# EAGLE design SfcDip2SoicAdapter (EAGLE 7.6.0)
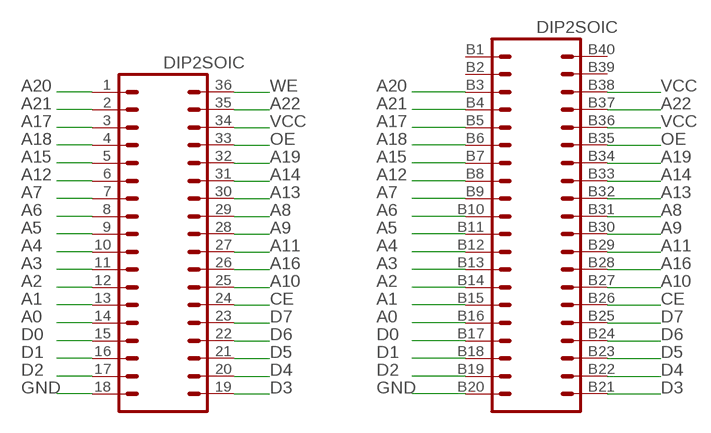
[diagram p0: schematic, sheet 1]

## Parts
DIP2SOIC  DIP36_OPENPTH  [DIP36_OPEN]

## Nets
A0: DIP2SOIC.14 DIP2SOIC.B16
A1: DIP2SOIC.13 DIP2SOIC.B15
A2: DIP2SOIC.12 DIP2SOIC.B14
A3: DIP2SOIC.11 DIP2SOIC.B13
A4: DIP2SOIC.10 DIP2SOIC.B12
A5: DIP2SOIC.9 DIP2SOIC.B11
A6: DIP2SOIC.8 DIP2SOIC.B10
A7: DIP2SOIC.7 DIP2SOIC.B9
A8: DIP2SOIC.29 DIP2SOIC.B31
A9: DIP2SOIC.28 DIP2SOIC.B30
A10: DIP2SOIC.25 DIP2SOIC.B27
A11: DIP2SOIC.27 DIP2SOIC.B29
A12: DIP2SOIC.6 DIP2SOIC.B8
A13: DIP2SOIC.30 DIP2SOIC.B32
A14: DIP2SOIC.31 DIP2SOIC.B33
A15: DIP2SOIC.5 DIP2SOIC.B7
A16: DIP2SOIC.26 DIP2SOIC.B28
A17: DIP2SOIC.3 DIP2SOIC.B5
A18: DIP2SOIC.4 DIP2SOIC.B6
A19: DIP2SOIC.32 DIP2SOIC.B34
A20: DIP2SOIC.1 DIP2SOIC.B3
A21: DIP2SOIC.2 DIP2SOIC.B4
A22: DIP2SOIC.35 DIP2SOIC.B37
CE: DIP2SOIC.24 DIP2SOIC.B26
D0: DIP2SOIC.15 DIP2SOIC.B17
D1: DIP2SOIC.16 DIP2SOIC.B18
D2: DIP2SOIC.17 DIP2SOIC.B19
D3: DIP2SOIC.19 DIP2SOIC.B21
D4: DIP2SOIC.20 DIP2SOIC.B22
D5: DIP2SOIC.21 DIP2SOIC.B23
D6: DIP2SOIC.22 DIP2SOIC.B24
D7: DIP2SOIC.23 DIP2SOIC.B25
GND: DIP2SOIC.18 DIP2SOIC.B20
OE: DIP2SOIC.33 DIP2SOIC.B35
VCC: DIP2SOIC.34 DIP2SOIC.B36 DIP2SOIC.B38
WE: DIP2SOIC.36
Unconnected: DIP2SOIC.B1 DIP2SOIC.B2 DIP2SOIC.B39 DIP2SOIC.B40

## Library data of the parts
DIP2SOIC = Adapter_DIP36:DIP36_OPEN: 1x16 .1" header

## Board
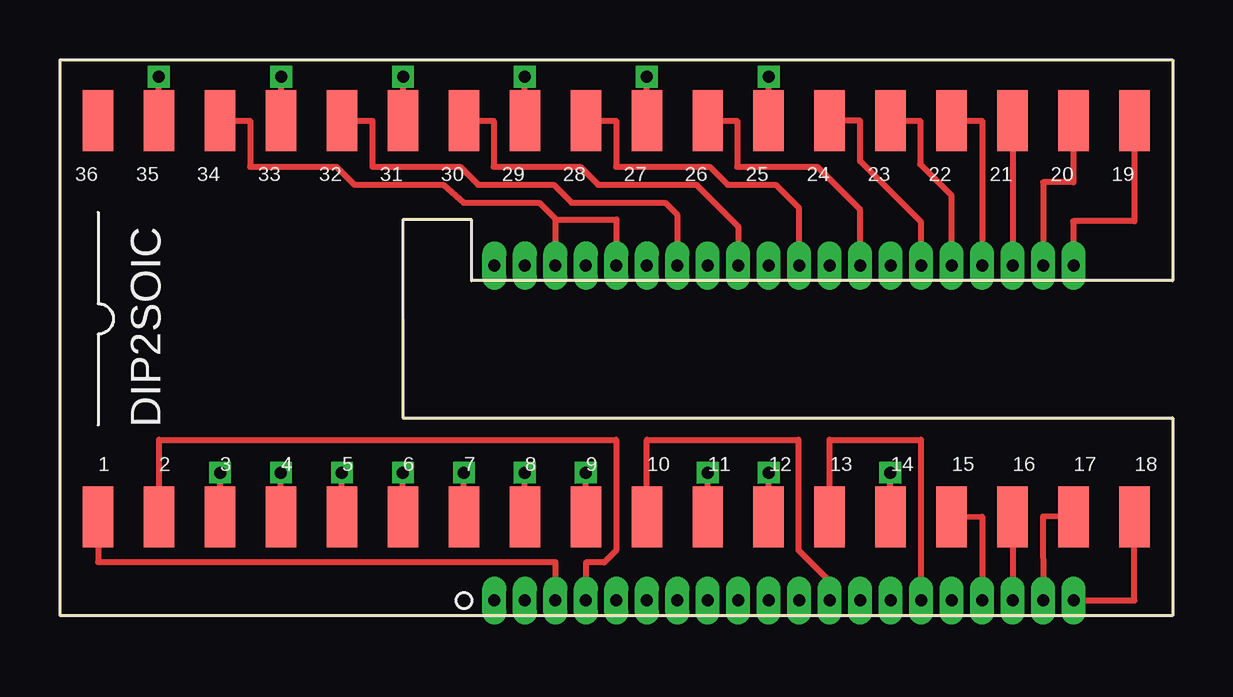
[diagram p1: board, top side]
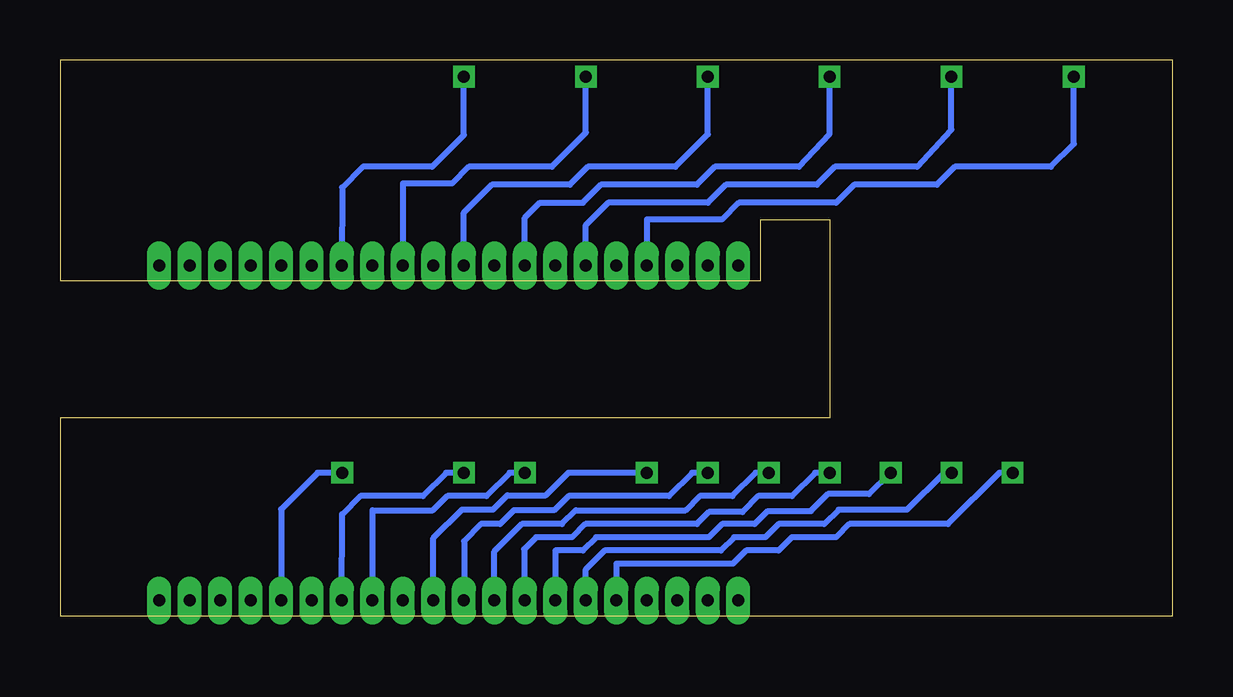
[diagram p2: board, bottom side, seen from below]

Size 46.36 x 23.18 mm. Coordinates in mm from the lower left corner, seen from the top.
Outline: 0,0 0,23.17 46.35,23.18 46.36,13.97 17.15,13.97 17.15,16.52 14.3,16.52 14.29,8.25 46.35,8.26 46.35,0 0,0
Copper layers (1*16): Top 0.035mm / dielectric 1.5mm / Bottom 0.035mm
Design rules "default": minimum track width 10mil, minimum drill 24mil, track to track 8mil, track to pad 8mil, pad to pad 8mil, via to via 8mil, smd to smd 8mil, copper to edge 40mil, drill to drill 8mil, minimum pad ring 10mil, minimum via ring 8mil, stop-mask expansion 4mil, vias tented up to drill 0mil, thermal gap 10mil

### Footprints (pad centres in the part's own frame; a part is rotated, then mirrored left to right if it is on the bottom)
DIP36_OPEN = smd 1.27 x 2.54: 1 1.587,4.128; 2 4.128,4.128; 3 6.668,4.128; 4 9.207,4.128; 5 11.748,4.128; 6 14.287,4.128; 7 16.828,4.128; 8 19.367,4.128; 9 21.907,4.128; 10 24.448,4.128; 11 26.988,4.128; 12 29.527,4.128; 13 32.068,4.128; 14 34.608,4.128; 15 37.148,4.128; 16 39.688,4.128; 17 42.227,4.128; 18 44.767,4.128; 19 44.767,20.637; 20 42.227,20.637; 21 39.688,20.637; 22 37.148,20.637; 23 34.608,20.637; 24 32.068,20.637; 25 29.527,20.637; 26 26.988,20.637; 27 24.448,20.637; 28 21.907,20.637; 29 19.367,20.637; 30 16.828,20.637; 31 14.287,20.637; 32 11.748,20.637; 33 9.207,20.637; 34 6.668,20.637; 35 4.128,20.637; 36 1.587,20.637 | drill 0.5 pad 0.813 long: B1 18.098,0.635; B2 19.367,0.635; B3 20.637,0.635; B4 21.907,0.635; B5 23.177,0.635; B6 24.448,0.635; B7 25.718,0.635; B8 26.988,0.635; B9 28.258,0.635; B10 29.527,0.635; B11 30.797,0.635; B12 32.068,0.635; B13 33.337,0.635; B14 34.608,0.635; B15 35.877,0.635; B16 37.148,0.635; B17 38.417,0.635; B18 39.688,0.635; B19 40.958,0.635; B20 42.227,0.635; B21 42.227,14.605; B22 40.958,14.605; B23 39.688,14.605; B24 38.417,14.605; B25 37.148,14.605; B26 35.877,14.605; B27 34.608,14.605; B28 33.337,14.605; B29 32.068,14.605; B30 30.797,14.605; B31 29.527,14.605; B32 28.258,14.605; B33 26.988,14.605; B34 25.718,14.605; B35 24.448,14.605; B36 23.177,14.605; B37 21.907,14.605; B38 20.637,14.605; B39 19.367,14.605; B40 18.098,14.605

### Placement (x,y rotation side)
DIP2SOIC  0,0 0 top

### Tracks (layer width: path | path; a pad name or v marks a point on that pad's centre or on a via)
A0  (via drill 0.5)
  Top 0.254: DIP2SOIC.14 v34.6,5.97
  Bottom 0.254: DIP2SOIC.B16 37.15,4.44 35.62,5.97 v34.6,5.97
A1
  Top 0.254: DIP2SOIC.13 32.07,7.34 35.88,7.34 DIP2SOIC.B15
A2  (via drill 0.5)
  Top 0.254: DIP2SOIC.12 v29.53,5.97
  Bottom 0.254: v29.53,5.97 30.27,5.97 31.24,5 33.84,5 34.61,4.23 DIP2SOIC.B14
A3  (via drill 0.5)
  Top 0.254: DIP2SOIC.11 v26.99,5.97
  Bottom 0.254: v26.99,5.97 27.62,5.97 28.59,5 30.22,5 30.82,4.4 33.34,4.4 DIP2SOIC.B13
A4
  Top 0.254: DIP2SOIC.10 24.45,7.34 30.77,7.34 30.77,2.75 32.07,1.44 DIP2SOIC.B12
A5  (via drill 0.5)
  Top 0.254: DIP2SOIC.9 v21.91,5.97
  Bottom 0.254: v21.91,5.97 25.17,5.97 26.12,5.02 27.72,5.02 28.32,4.42 29.62,4.42 30.8,3.24 DIP2SOIC.B11
A6  (via drill 0.5)
  Top 0.254: DIP2SOIC.8 v19.37,5.97
  Bottom 0.254: v19.37,5.97 20.02,5.97 20.99,5 25.17,5 25.77,4.4 27.44,4.4 28.02,3.82 28.82,3.82 29.52,3.12 29.52,1 DIP2SOIC.B10
A7  (via drill 0.5)
  Top 0.254: DIP2SOIC.7 v16.83,5.97
  Bottom 0.254: v16.83,5.97 17.37,5.97 18.34,5 19.69,5 20.29,4.4 24.87,4.4 25.44,3.82 27.12,3.82 28.26,2.68 DIP2SOIC.B9
A8  (via drill 0.5)
  Top 0.254: DIP2SOIC.29 v19.37,22.48
  Bottom 0.254: DIP2SOIC.B31 29.53,16.81 28.37,17.97 25.12,17.97 24.37,18.72 20.72,18.72 19.37,20.07 v19.37,22.48
A9
  Top 0.254: DIP2SOIC.28 23.17,20.64 23.17,18.72 27.07,18.72 27.82,17.97 29.82,17.97 30.8,16.99 DIP2SOIC.B30
A10  (via drill 0.5)
  Top 0.254: DIP2SOIC.25 v29.53,22.48
  Bottom 0.254: DIP2SOIC.B27 34.61,17.86 33.74,18.72 30.86,18.72 29.53,20.05 v29.53,22.48
A11  (via drill 0.5)
  Top 0.254: DIP2SOIC.27 v24.44,22.48
  Bottom 0.254: DIP2SOIC.B29 32.07,18.02 30.02,18.02 29.32,18.72 25.87,18.72 24.44,20.15 v24.44,22.48
A12  (via drill 0.5)
  Top 0.254: DIP2SOIC.6 v14.29,5.97
  Bottom 0.254: DIP2SOIC.B8 27.02,1.02 27.02,2.77 26.52,3.27 25.02,3.27 24.47,3.82 19.82,3.82 19.32,4.32 17.92,4.32 17.27,5 15.87,5 14.9,5.97 v14.29,5.97
A13
  Top 0.254: DIP2SOIC.30 18.07,20.64 18.07,18.72 21.67,18.72 22.42,17.97 26.52,17.97 28.27,16.22 28.27,14.97 DIP2SOIC.B32
A14  (via drill 0.5)
  Top 0.254: DIP2SOIC.31 v14.29,22.48
  Bottom 0.254: DIP2SOIC.B33 26.99,16.6 26.37,17.22 24.57,17.22 23.82,17.97 19.82,17.97 19.07,18.72 15.57,18.72 14.29,20.1 v14.29,22.48
A15  (via drill 0.5)
  Top 0.254: DIP2SOIC.5 v11.75,5.97
  Bottom 0.254: DIP2SOIC.B7 25.72,2.72 24.57,2.72 24.02,3.27 19.32,3.27 18.77,3.82 17.42,3.82 16.87,4.37 15.07,4.37 14.37,5.07 12.64,5.07 v11.75,5.97
A16
  Top 0.254: DIP2SOIC.26 28.22,20.64 28.22,18.72 31.54,18.72 33.34,16.93 DIP2SOIC.B28
A17  (via drill 0.5)
  Top 0.254: 6.67,4.64 DIP2SOIC.3 v6.67,5.97
  Bottom 0.254: v6.67,5.97 7.22,5.97 9.37,3.82 13.47,3.82 14.02,3.27 15.87,3.27 16.42,2.72 17.77,2.72 18.32,2.17 23.18,2.17 DIP2SOIC.B5
A18  (via drill 0.5)
  Top 0.254: DIP2SOIC.4 v9.21,5.97
  Bottom 0.254: v9.21,5.97 9.52,5.97 11.07,4.42 13.92,4.42 14.52,3.82 16.42,3.82 16.97,3.27 18.27,3.27 18.82,2.72 23.67,2.72 24.45,1.94 DIP2SOIC.B6
A19
  Top 0.254: DIP2SOIC.32 13.02,20.64 13.02,18.72 16.67,18.72 17.42,17.97 20.57,17.97 21.32,17.22 25.22,17.22 25.72,16.72 DIP2SOIC.B34
A20
  Top 0.254: DIP2SOIC.1 1.59,2.25 20.64,2.25 DIP2SOIC.B3
A21
  Top 0.254: DIP2SOIC.2 4.13,7.34 23.17,7.34 23.17,2.72 22.67,2.22 21.91,2.22 DIP2SOIC.B4
A22  (via drill 0.5)
  Top 0.254: DIP2SOIC.35 v4.12,22.48
  Bottom 0.254: DIP2SOIC.B37 21.91,16.52 18.77,16.52 18.07,17.22 14.02,17.22 13.27,17.97 9.82,17.97 9.07,18.72 5.07,18.72 4.12,19.67 v4.12,22.48
CE
  Top 0.254: DIP2SOIC.B26 35.88,16.41 33.34,18.95 33.34,20.64 DIP2SOIC.24
D0
  Top 0.254: DIP2SOIC.15 38.42,4.14 DIP2SOIC.B17
D1
  Top 0.254: DIP2SOIC.16 DIP2SOIC.B18
D2
  Top 0.254: DIP2SOIC.17 40.96,4.14 DIP2SOIC.B19
D3
  Top 0.254: DIP2SOIC.19 44.77,16.45 42.22,16.45 42.22,14.65 DIP2SOIC.B21
D4
  Top 0.254: DIP2SOIC.20 42.23,18.07 40.97,18.07 40.97,14.96 DIP2SOIC.B22
D5
  Top 0.254: DIP2SOIC.21 DIP2SOIC.B23
D6
  Top 0.254: DIP2SOIC.22 38.42,20.64 DIP2SOIC.B24
D7
  Top 0.254: DIP2SOIC.23 35.84,20.64 35.84,18.82 37.15,17.52 DIP2SOIC.B25
GND
  Top 0.254: DIP2SOIC.B20 44.77,0.64 DIP2SOIC.18
OE  (via drill 0.5)
  Top 0.254: DIP2SOIC.33 v9.22,22.48
  Bottom 0.254: v9.22,22.48 9.22,20.27 10.64,18.72 14.07,18.72 14.82,17.97 18.62,17.97 19.37,17.22 23.52,17.22 24.45,16.29 DIP2SOIC.B35
VCC
  Top 0.254: DIP2SOIC.34 7.92,20.64 7.92,18.72 11.52,18.72 12.27,17.97 15.97,17.97 16.82,17.22 19.97,17.22 20.67,16.52 | 20.67,16.52 23.18,16.52 DIP2SOIC.B36 | 20.67,16.52 20.64,16.52 DIP2SOIC.B38